# EAGLE design pga103_lna_filtered (EAGLE 8.3.1)
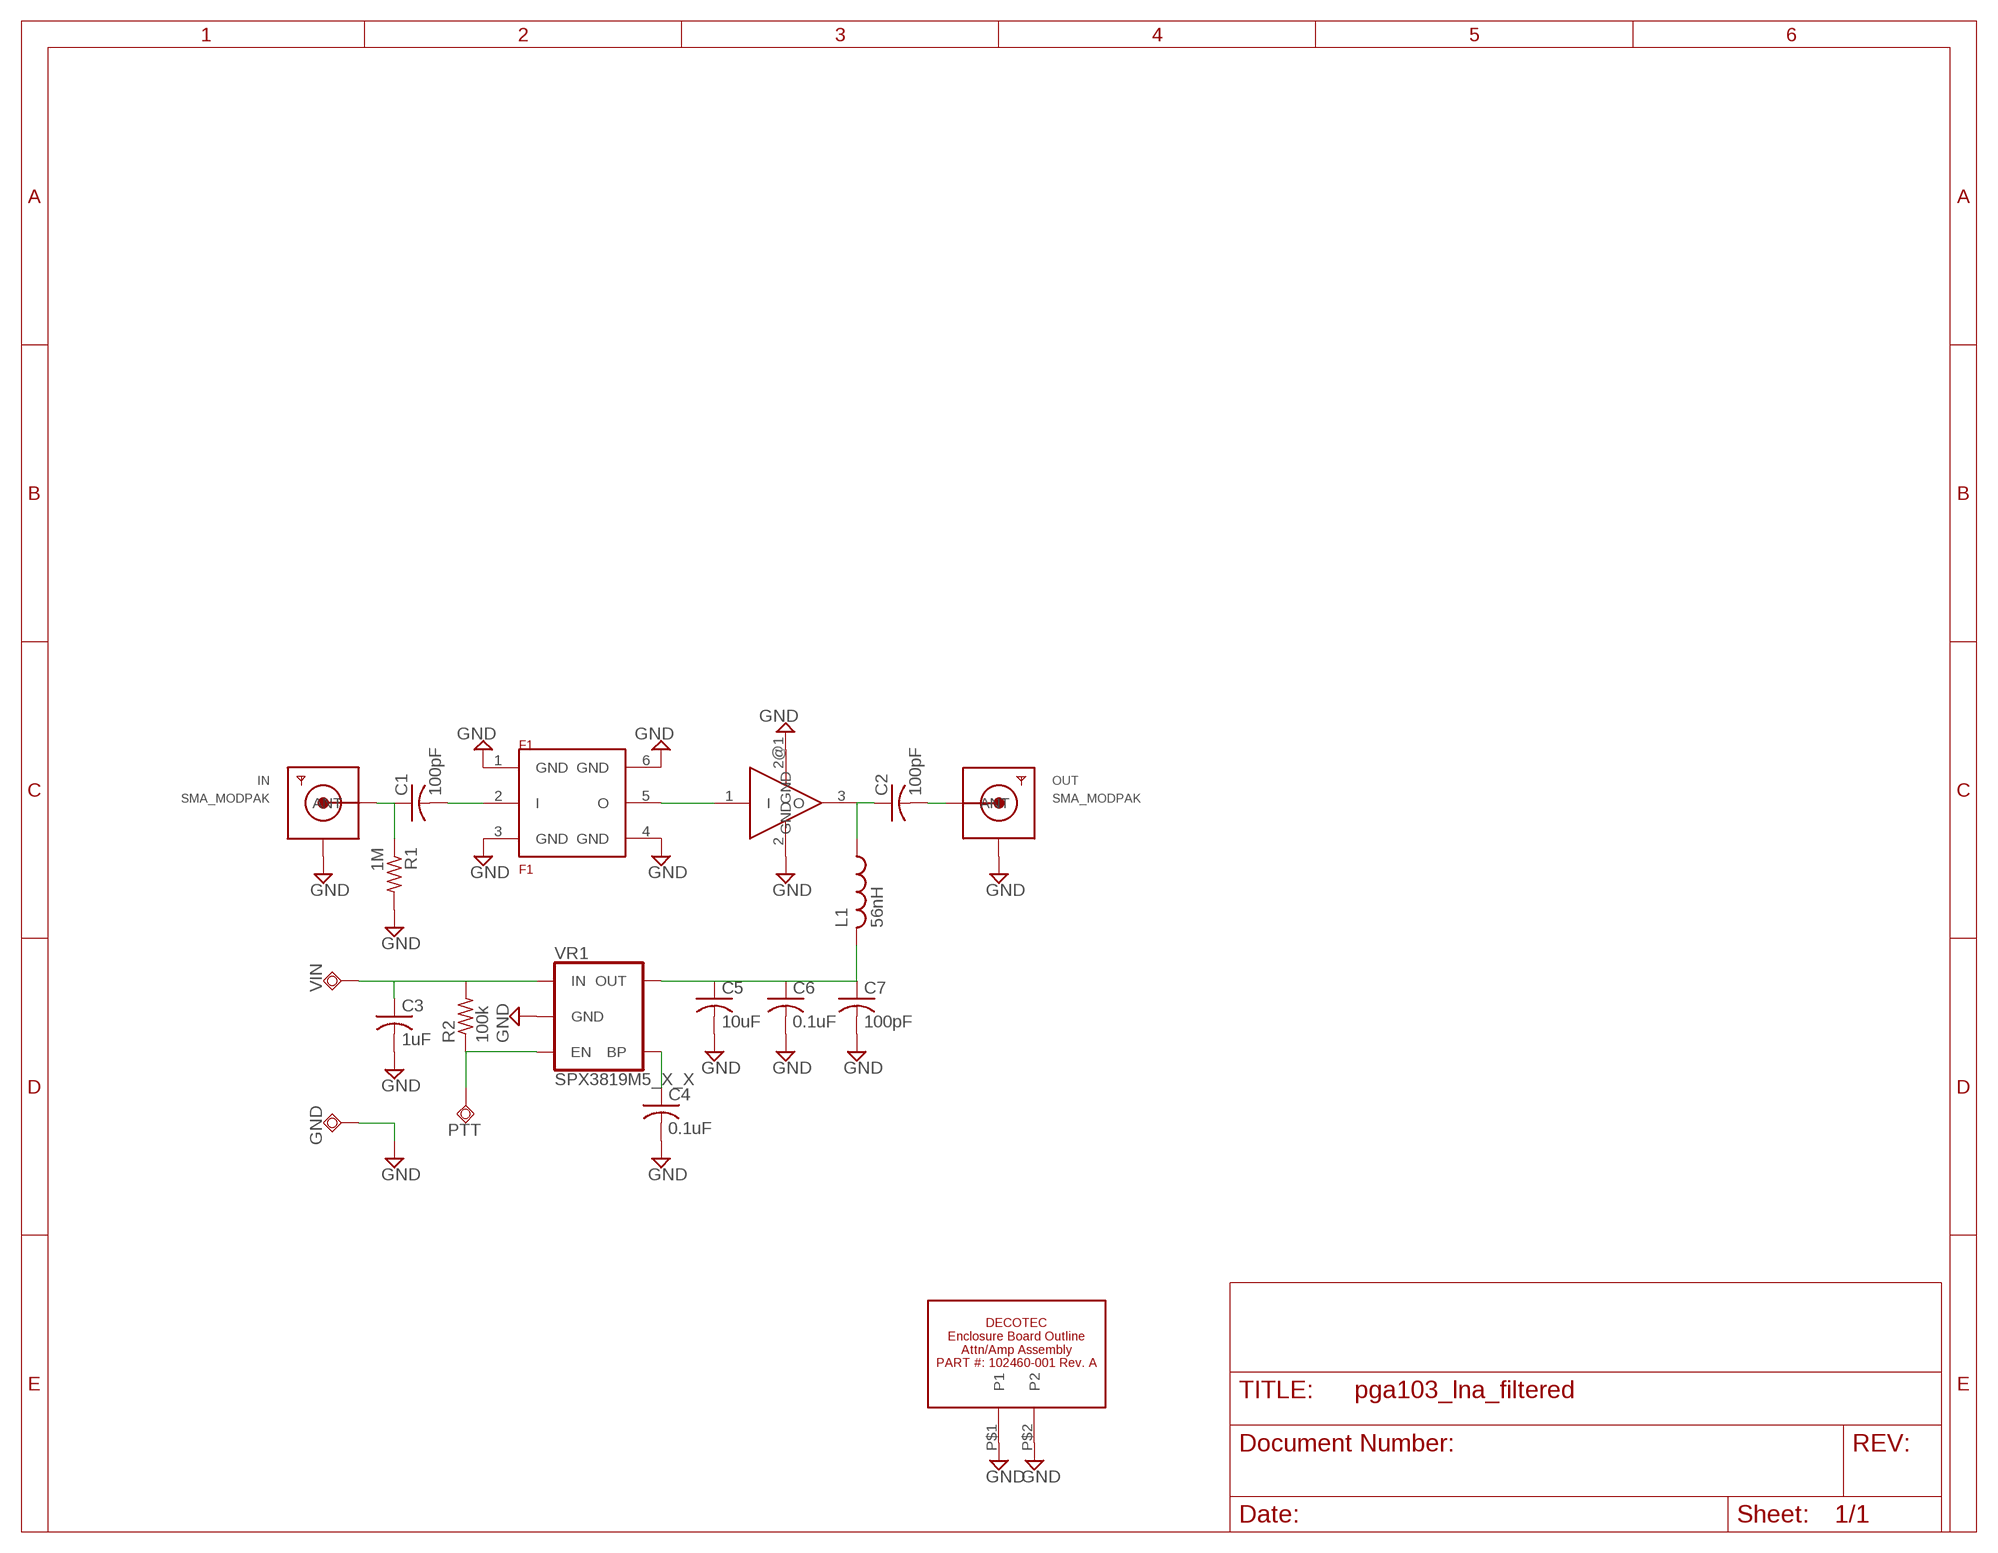
[diagram p0: schematic, sheet 1]

## Parts
A1  PGA-103+  [SOT89]
C1  100pF  C-USC0805K  [C0805K]
C2  100pF  C-USC0805K  [C0805K]
C3  1uF  C-USC0805K  [C0805K]
C4  0.1uF  C-USC0805K  [C0805K]
C5  10uF  C-USC0805K  [C0805K]
C6  0.1uF  C-USC0805K  [C0805K]
C7  100pF  C-USC0805K  [C0805K]
F1  F1  SF2136E  [SM3030-6]
GND  TPSQTP20SQ  [TP20SQ]
IN  SMA_MODPAK  [SMA_MODPAK_V1]
L1  56nH  L-US0805K  [C0805K]
OUT  SMA_MODPAK  [SMA_MODPAK_V1]
PTT  TPSQTP20SQ  [TP20SQ]
R1  1M  R-US_R0805  [R0805]
R2  100k  R-US_R0805  [R0805]
U$1  DECOTEC_102460-001A  [DECOTEC_102460-001A]
VIN  TPSQTP20SQ  [TP20SQ]
VR1  SPX3819M5_X_X  V_REG_SPX3819-SOT23-5  [SOT23-5]

## Nets
GND: A1.2(GND) A1.2@1(GND) C3.2 C4.2 C5.2 C6.2 C7.2 F1.1(GND) F1.3(GND) F1.4(GND) F1.6(GND) GND.TP IN.GND@1(GND1) OUT.GND@1(GND1) R1.2 U$1.P$1(P1) U$1.P$2(P2) VR1.2(GND)
N$1: C1.1 IN.P(ANT) R1.1
N$2: C1.2 F1.2(I)
N$3: C2.2 OUT.P(ANT)
N$4: A1.3(O) C2.1 L1.1
N$5: A1.1(I) F1.5(O)
N$7: C5.1 C6.1 C7.1 L1.2 VR1.5(OUT)
N$10: C4.1 VR1.4(BP)
PTT: PTT.TP R2.1 VR1.3(EN)
VIN: C3.1 R2.2 VIN.TP VR1.1(IN)

## Library data of the parts
A1 = kj4qlp:PGA-103+
C1-C7 = rcl:C-US: CAPACITOR, American symbol
F1 = kj4qlp:SF2136E
GND PTT VIN = testpad:TPSQ: Test pad
IN OUT = vtgs:SMA_MODPAK
L1 = kj4qlp:L-US0805K
R1 R2 = rcl:R-US_: RESISTOR, American symbol
U$1 = vtgs:DECOTEC_102460-001A
VR1 = kj4qlp:V_REG_SPX3819: SPX3819 Voltage Regulator 3.3V 500mA, 16V input Datasheet <https://www.exar.com/content/document.ashx?id=22106> SparkFun Products: SparkFun Serial Controlled Motor Driver <https://www.sparkfun.com/products/13911>; PROD_ID: VREG-13321

## Board
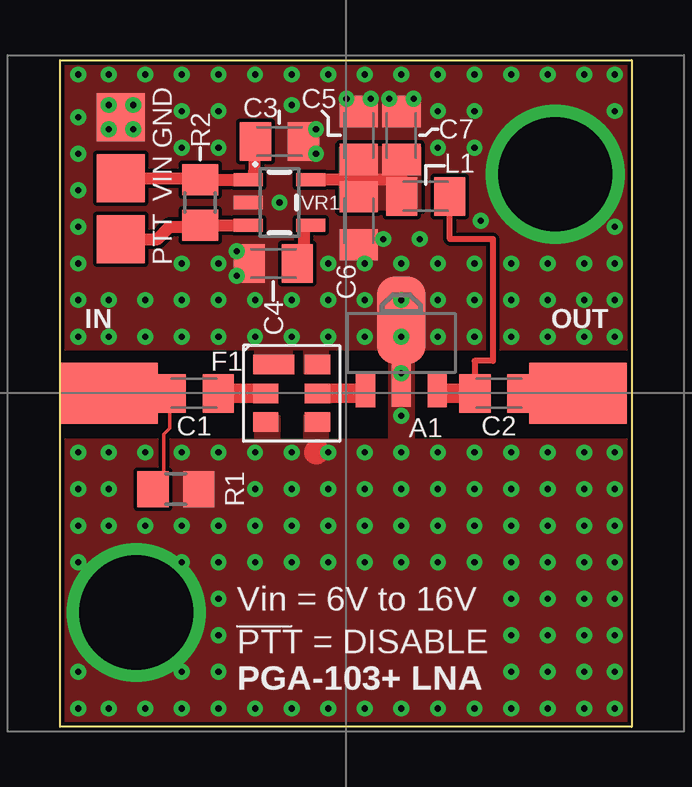
[diagram p1: board, top side]
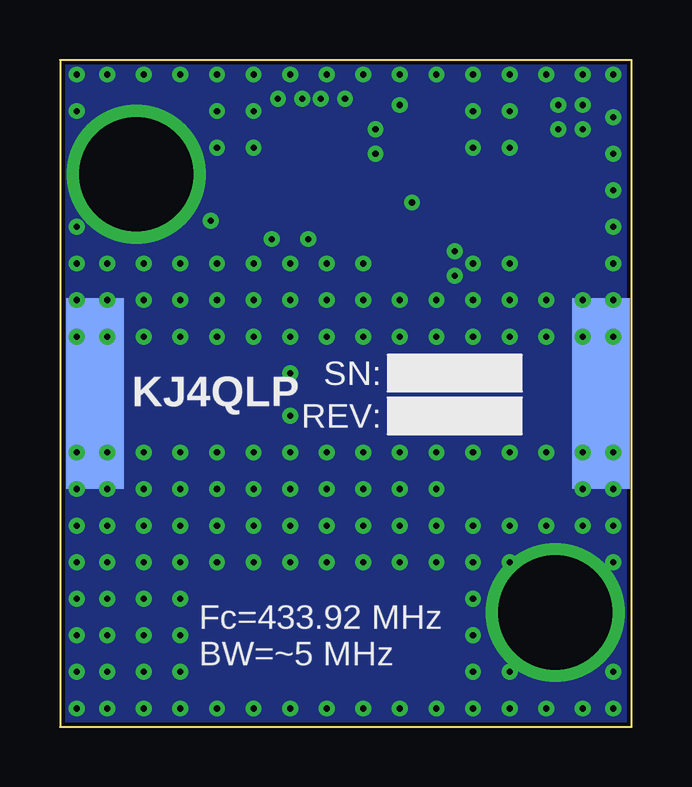
[diagram p2: board, bottom side, seen from below]

Size 23.81 x 27.78 mm. Coordinates in mm from the lower left corner, seen from the top.
Copper layers (1*16): Top 0.035mm / dielectric 1.5mm / Bottom 0.035mm
Design rules "default *": minimum track width 6mil, minimum drill 0.35mm, track to track 6mil, track to pad 6mil, pad to pad 6mil, via to via 6mil, smd to smd 6mil, copper to edge 6mil, drill to drill 6mil, minimum pad ring 10mil, minimum via ring 8mil, stop-mask expansion 4mil, vias tented up to drill 0mil, thermal gap 10mil

### Footprints (pad centres in the part's own frame; a part is rotated, then mirrored left to right if it is on the bottom)
SOT89 = smd 0.8 x 1.4: 1 -1.499,-1.981; 3 1.499,-1.981 | smd 0.8 x 1.9: 2 0,-1.727 | smd 2.032 x 3.65: 2@1 0,0.94
C0805K = smd 1.3 x 1.6: 1 -1,0; 2 1,0
SM3030-6 = smd 1.7 x 0.81: 1 -0.75,1.195 | smd 1.05 x 0.81: 2 -1.075,0; 3 -1.075,-1.195; 4 1.075,-1.195; 5 1.075,0; 6 1.075,1.195
TP20SQ = smd 2 x 2: TP 0,0
SMA_MODPAK_V1 = smd 2.381 x 7.938 bottom: GND@1 1.27,0 | smd 4.064 x 2.54: P 2.032,0
R0805 = smd 1.3 x 1.5: 1 -0.95,0; 2 0.95,0
DECOTEC_102460-001A = drill 4.763 pad 5.08: P$1 3.175,4.763; P$2 20.637,23.019
SOT23-5 = smd 0.55 x 1.2: 1 -0.95,-1.3; 2 0,-1.3; 3 0.95,-1.3; 4 0.95,1.3; 5 -0.95,1.3

### Placement (x,y rotation side)
A1  14.22,16 0 top
C1  5.59,13.89 0 top
C2  18.29,13.89 0 top
C3  9.14,24.38 0 top
C4  8.89,19.3 180 top
C5  12.45,24.64 90 top
C6  12.45,21.08 270 top
C7  14.22,24.64 90 top
F1  9.65,13.89 0 top
GND  2.54,25.4 0 top
IN  0,13.89 0 top
L1  15.24,22.1 180 top
OUT  23.62,13.89 180 top
PTT  2.54,20.32 0 top
R1  4.83,9.91 0 top
R2  5.84,21.84 90 top
U$1  0,0 0 top
VIN  2.54,22.86 0 top
VR1  9.14,21.84 270 top

### Tracks (layer width: path | path; a pad name or v marks a point on that pad's centre or on a via)
GND  (via drill 0.25)
  Top 1.016: 10.73,11.49 10.67,11.43
  other vias: 0.76,27.18 23.11,17.78 12.7,17.78 14.22,19.3 15.75,19.3 5.08,16.26 3.56,16.26 2.03,16.26 0.76,16.26 5.08,11.43 8.13,11.43 6.6,11.43 9.65,11.43 11.18,11.43 12.7,11.43 14.22,11.43 15.75,11.43 23.11,11.43 17.27,11.43 18.8,11.43 23.11,16.26 21.84,16.26 20.32,17.78 20.32,16.26 23.11,19.3 8.13,16.26 21.84,19.3 6.6,16.26 0.76,9.91 11.18,0.76 12.7,0.76 14.22,0.76 3.56,11.43 11.18,17.78 15.75,17.78 9.14,21.84 2.03,27.18 3.56,27.18 5.08,27.18 6.6,27.18 12.7,27.18 14.22,27.18 15.75,27.18 17.27,27.18 18.8,27.18 0.76,17.78 0.76,20.83 0.76,23.88 0.76,25.4 18.8,16.26 2.03,17.78 3.56,17.78 10.67,24.89 10.67,23.88 11.94,26.16 12.95,26.16 13.72,26.16 14.73,26.16 21.84,17.78 17.27,16.26 17.27,17.78 6.6,17.78 5.08,17.78 20.32,11.43 21.84,11.43 2.03,11.43 0.76,11.43 9.65,16.26 11.18,16.26 0.76,8.38 0.76,6.86 0.76,2.29 0.76,0.76 2.03,0.76 3.56,0.76 5.08,0.76 6.6,0.76 8.13,0.76 9.65,0.76 15.75,0.76 17.27,0.76 18.8,0.76 20.32,0.76 21.84,0.76 23.11,0.76 2.03,9.91 2.03,8.38 6.6,2.29 6.6,3.81 6.6,5.33 6.6,6.86 8.13,6.86 9.65,6.86 11.18,6.86 11.18,8.38 9.65,8.38 8.13,8.38 6.6,8.38 5.08,8.38 3.56,8.38 9.65,9.91 11.18,9.91 12.7,9.91 14.22,9.91 15.75,9.91 17.27,9.91 18.8,9.91 20.32,9.91 12.7,8.38 14.22,8.38 15.75,8.38 17.27,8.38 18.8,8.38 20.32,8.38 20.32,6.86 18.8,6.86 17.27,6.86 15.75,6.86 14.22,6.86 12.7,6.86 21.84,2.29 23.11,2.29 23.11,3.81 23.11,5.33 23.11,6.86 23.11,8.38 23.11,9.91 21.84,9.91 21.84,8.38 21.84,6.86 21.84,5.33 21.84,3.81 8.13,17.78 9.65,17.78 20.32,19.3 0.76,19.3 0.76,22.35 8.13,27.18 9.65,27.18 11.18,27.18 5.08,25.65 6.6,25.65 6.6,24.13 5.08,24.13 17.27,19.3 13.46,20.32 20.32,27.18 21.84,27.18 23.11,27.18 23.11,25.65 17.27,24.13 12.7,19.3 14.22,17.78 14.22,16.26 12.7,16.26 14.22,12.95 15.75,16.26 14.22,14.73 5.08,19.3 6.6,19.3 14.99,20.32 15.75,25.65 17.27,25.65 20.32,5.33 20.32,3.81 20.32,2.29 18.8,2.29 18.8,3.81 18.8,5.33 2.03,25.91 3.05,25.91 3.05,24.89 2.03,24.89 23.11,20.83 18.8,19.3 8.13,9.91 15.75,24.13 7.37,19.81 7.37,18.8 11.18,19.3 18.8,17.78 17.53,21.08 5.08,6.86 5.08,2.29 9.65,25.91
  pour Bottom (no thermals): 0,27.69 23.62,27.69 23.62,0.25 0,0.25
  pour Top (rank 2, no thermals): 0,27.69 23.62,27.69 23.62,15.75 0,15.75
  pour Top (no thermals): 0,11.94 23.62,11.94 23.62,0 0,0
  pour Top (no thermals): 13.72,15.24 14.73,15.24 14.73,11.94 13.72,11.94
  pour Top (no thermals): 8.13,14.73 8.13,15.75 9.65,15.75 9.65,14.73
  pour Top (no thermals): 11.18,14.73 11.18,15.75 10.16,15.75 10.16,14.73
  pour Top (no thermals): 8.13,11.94 8.13,12.95 9.14,12.95 9.14,11.94
  pour Top (no thermals): 11.18,11.94 11.18,12.95 10.16,12.95 10.16,11.94
N$1
  Top 0.152: C1.1 4.57,13.88 4.57,12.45 4.32,12.19 4.32,9.91 R1.1
  Top 1.016: C1.1 IN.P
N$2
  Top 0.813: F1.2 C1.2
N$3
  Top 1.016: OUT.P C2.2
N$4
  Top 0.254: L1.1 16.24,20.34 16.26,20.32 18.03,20.32 18.03,15.24 17.27,15.24 17.27,13.91 C2.1
  Top 0.813: C2.1 15.72,13.89 A1.3
N$5
  Top 0.813: F1.5 12.72,13.89 A1.1
N$7
  Top 0.508: 12.45,22.79 VR1.5 | 14.16,22.79 12.45,22.79 | 14.16,22.79 14.22,22.86 C7.1 | C5.1 12.45,22.8 12.45,22.79 | C6.1 12.45,22.79 | L1.2 14.24,22.71 14.16,22.79
  pour Top (no thermals): 11.68,24.13 11.68,21.59 14.99,21.59 14.99,24.13
N$10
  Top 0.508: C4.1 10.16,19.3 10.16,20.83 10.23,20.89 VR1.4
PTT
  Top 0.508: VR1.3 R2.1 5.78,20.83 4.57,20.83 4.06,20.32 PTT.TP
VIN
  Top 0.508: R2.2 VR1.1 8.1,22.81 C3.1 | R2.2 5.78,22.86 | VIN.TP 5.78,22.86 | 5.78,22.86 R2.2

### Text on the board
tPlace: Vin = 6V to 16V | PTT = DISABLE | PGA-103+ LNA
bPlace: SN: | KJ4QLP | REV: | Fc=433.92 MHz / BW=~5 MHz